# Altium schematic sheet 小四轴.SchDoc
size A3
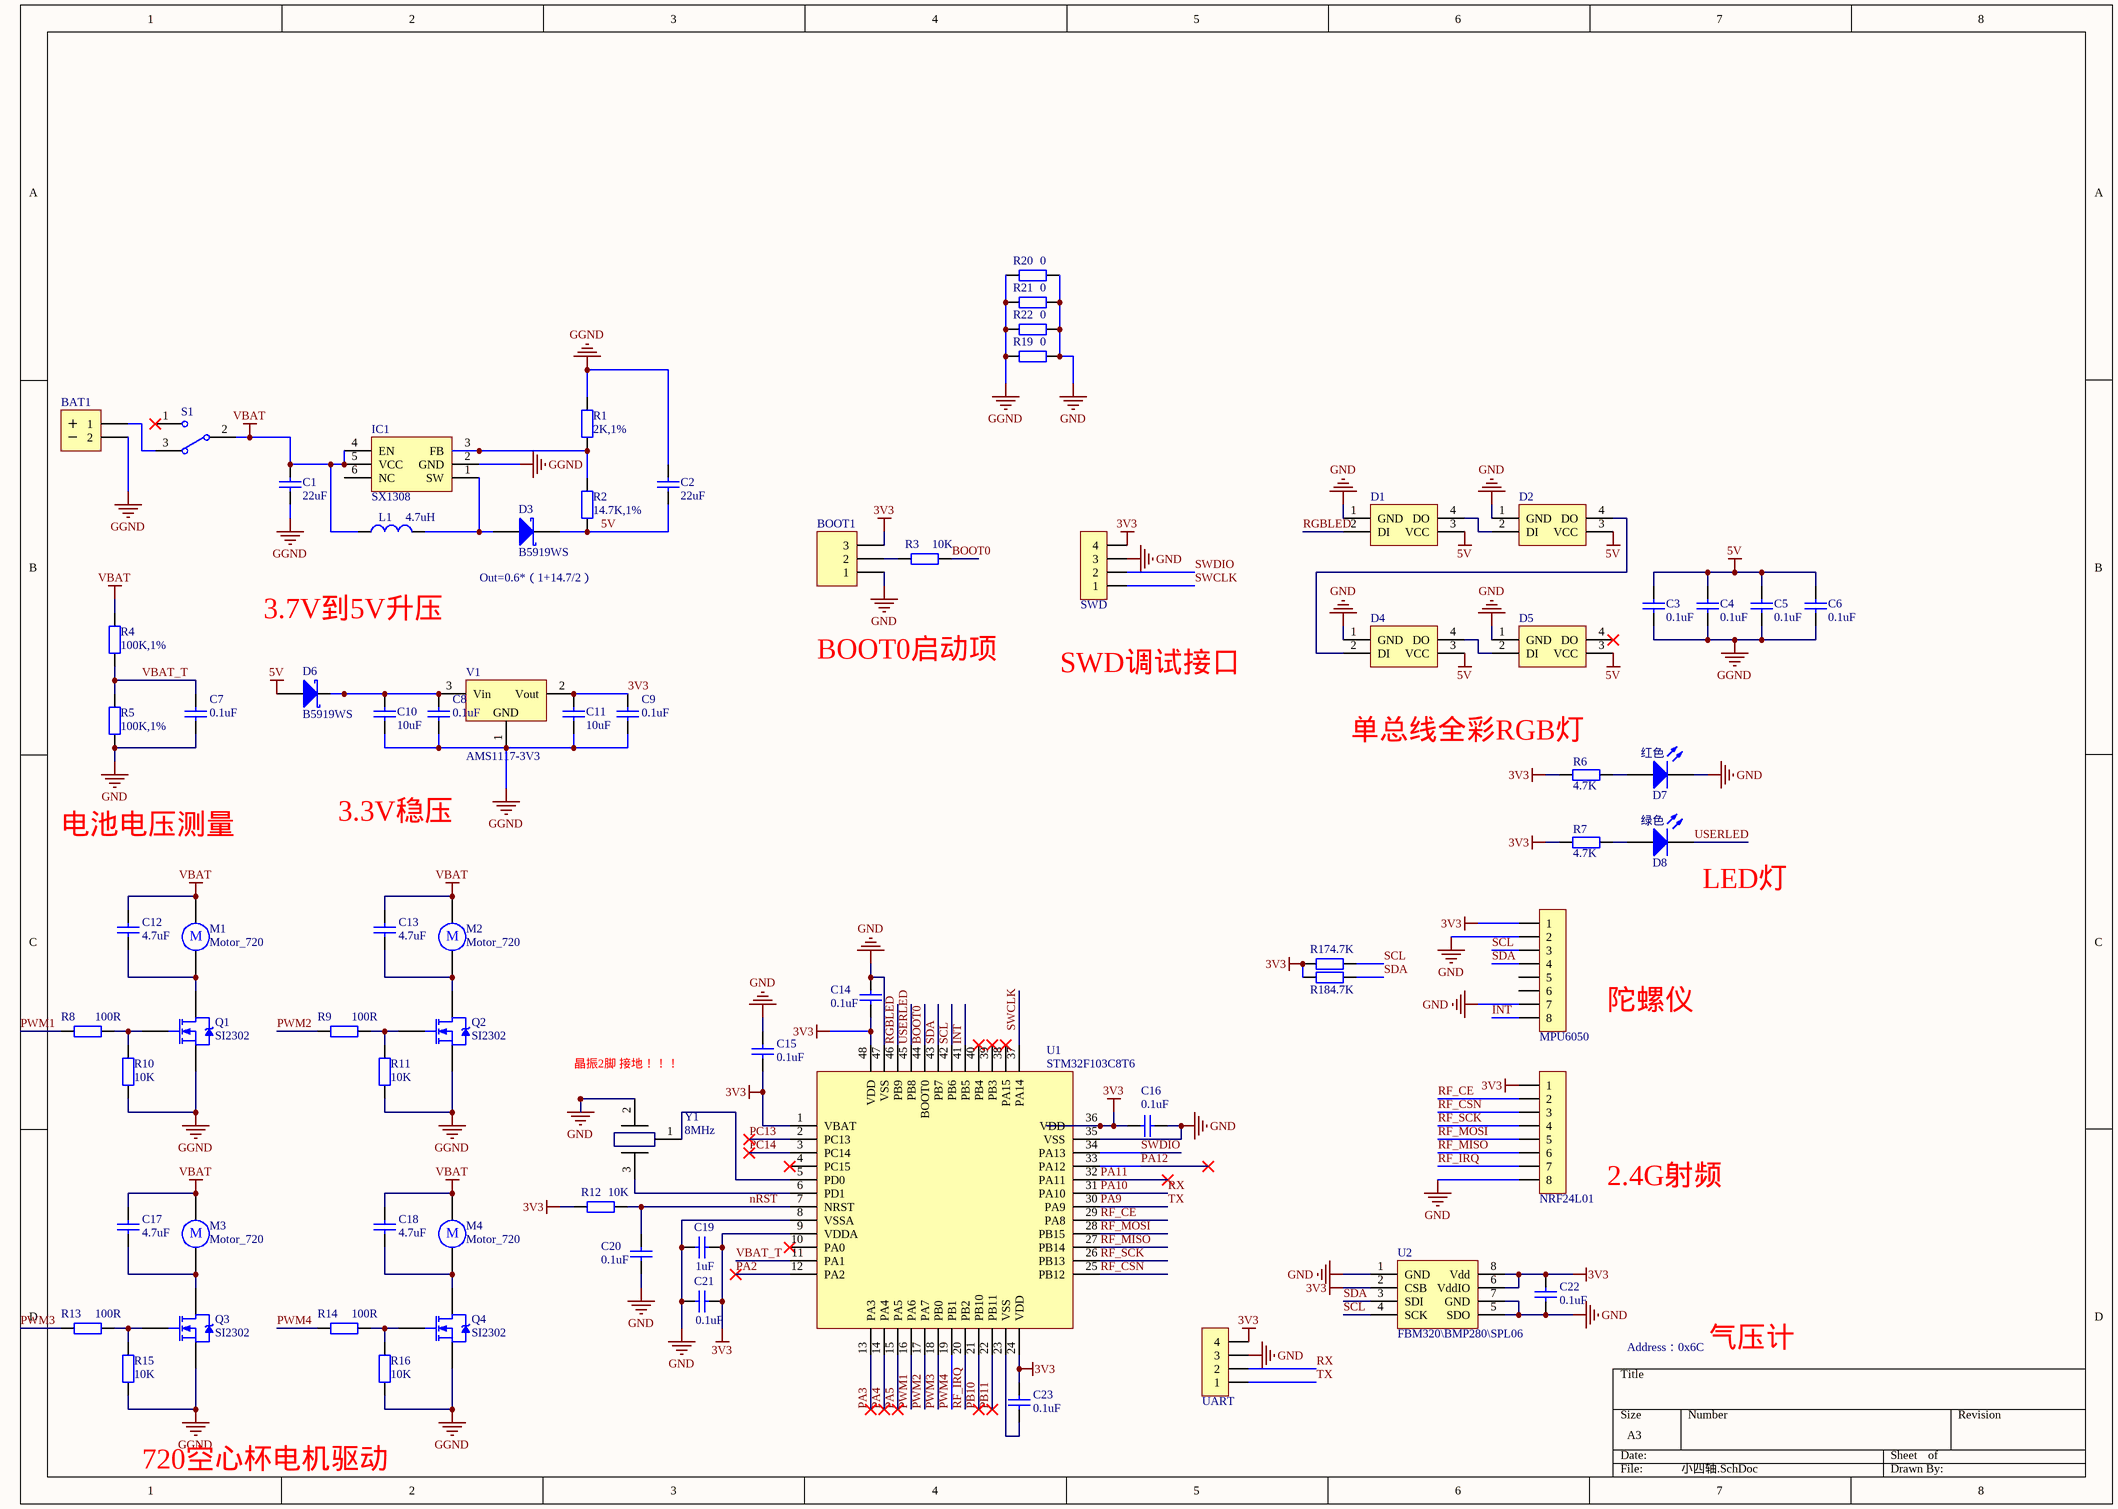
[diagram p0: 小四轴.SchDoc]

## Parts
BAT1  BAT  [HDR2.54-LI-2P]  (value not drawn)
BOOT1  BOOT  [HDR2.54-LI-3P]  (value not drawn)
C1  value 22uF  [C 0603_M]  (hidden comment: C_0603)
C2  value 22uF  [C 0603_M]  (hidden comment: C_0603)
C3  value 0.1uF  [C 0603_M]  (hidden comment: C_0603)
C4  value 0.1uF  [C 0603_M]  (hidden comment: C_0603)
C5  value 0.1uF  [C 0603_M]  (hidden comment: C_0603)
C6  value 0.1uF  [C 0603_M]  (hidden comment: C_0603)
C7  value 0.1uF  [C 0603_M]  (hidden comment: C_0603)
C8  value 0.1uF  [C 0603_M]  (hidden comment: C_0603)
C9  value 0.1uF  [C 0603_M]  (hidden comment: C_0603)
C10  value 10uF  [C 0603_M]  (hidden comment: C_0603)
C11  value 10uF  [C 0603_M]  (hidden comment: C_0603)
C12  value 4.7uF  [C 0603_M]  (hidden comment: C_0603)
C13  value 4.7uF  [C 0603_M]  (hidden comment: C_0603)
C14  value 0.1uF  [C 0603_M]  (hidden comment: C_0603)
C15  value 0.1uF  [C 0603_M]  (hidden comment: C_0603)
C16  value 0.1uF  [C 0603_M]  (hidden comment: C_0603)
C17  value 4.7uF  [C 0603_M]  (hidden comment: C_0603)
C18  value 4.7uF  [C 0603_M]  (hidden comment: C_0603)
C19  value 1uF  [C 0603_M]  (hidden comment: C_0603)
C20  value 0.1uF  [C 0603_M]  (hidden comment: C_0603)
C21  value 0.1uF  [C 0603_M]  (hidden comment: C_0603)
C22  value 0.1uF  [C 0603_M]  (hidden comment: C_0603)
C23  value 0.1uF  [C 0603_M]  (hidden comment: C_0603)
D1  P923D  [RGB_LED_5050]  (value not drawn)
D2  P923D  [RGB_LED_5050]  (value not drawn)
D3  B5919WS  [SOD-323]
D4  P923D  [RGB_LED_5050]  (value not drawn)
D5  P923D  [RGB_LED_5050]  (value not drawn)
D6  B5919WS  [SOD-323]
D7  红色  [LED 0603B]
D8  绿色  [LED 0603B]
IC1  SX1308  [SOT23-6N]
L1  value 4.7uH  [SWPA4012S]  (hidden comment: Inductor)
M1  Motor_720  [ZH1.5-LI-2p]
M2  Motor_720  [ZH1.5-LI-2p]
M3  Motor_720  [ZH1.5-LI-2p]
M4  Motor_720  [ZH1.5-LI-2p]
MPU6050  HDR-1X8  [HDR2.54-LI-8P]  (value not drawn)
NRF24L01  HDR-1X8  [HDR1.27-LI-8P]  (value not drawn)
Q1  SI2302  [SOT23-3M]
Q2  SI2302  [SOT23-3M]
Q3  SI2302  [SOT23-3M]
Q4  SI2302  [SOT23-3M]
R1  value 2K,1%  [R 0603_M]  (hidden comment: R_0603)
R2  value 14.7K,1%  [R 0603_M]  (hidden comment: R_0603)
R3  value 10K  [R 0603_M]  (hidden comment: R_0603)
R4  value 100K,1%  [R 0603_M]  (hidden comment: R_0603)
R5  value 100K,1%  [R 0603_M]  (hidden comment: R_0603)
R6  value 4.7K  [R 0603_M]  (hidden comment: R_0603)
R7  value 4.7K  [R 0603_M]  (hidden comment: R_0603)
R8  value 100R  [R 0603_M]  (hidden comment: R_0603)
R9  value 100R  [R 0603_M]  (hidden comment: R_0603)
R10  value 10K  [R 0603_M]  (hidden comment: R_0603)
R11  value 10K  [R 0603_M]  (hidden comment: R_0603)
R12  value 10K  [R 0603_M]  (hidden comment: R_0603)
R13  value 100R  [R 0603_M]  (hidden comment: R_0603)
R14  value 100R  [R 0603_M]  (hidden comment: R_0603)
R15  value 10K  [R 0603_M]  (hidden comment: R_0603)
R16  value 10K  [R 0603_M]  (hidden comment: R_0603)
R17  value 4.7K  [R 0603_M]  (hidden comment: R_0603)
R18  value 4.7K  [R 0603_M]  (hidden comment: R_0603)
R19  value 0  [R 0603_M]  (hidden comment: R_0603)
R20  value 0  [R 0603_M]  (hidden comment: R_0603)
R21  value 0  [R 0603_M]  (hidden comment: R_0603)
R22  value 0  [R 0603_M]  (hidden comment: R_0603)
S1  SW-SPDT  [SW-TH_OS102011MS2QN1]  (value not drawn)
SWD  HDR-1X4  [HDR2.54-LI-4P]  (value not drawn)
U1  STM32F103C8T6  [LQFP48-7*7]
U2  FBM320\BMP280\SPL06  [SENSOR-TH_BMP280-BL]
UART  HDR-1X4  [HDR2.54-LI-4P]  (value not drawn)
V1  AMS1117-3V3  [SOT223_L]
Y1  value 8MHz  [OSC-SMD_3P-L3.2-W1.3-P1.20-L]  (hidden comment: XTAL)

## Nets
3V3: BOOT1.3 C9.2 C11.2 C14.1 C15.2 C16.2 C19.2 C21.2 C22.1 C23.1 MPU6050.1 NRF24L01.1 R6.1 R7.1 R12.2 R17.1 R18.1 SWD.4 U1.1(VBAT) U1.9(VDDA) U1.24(VDD) U1.36(VDD) U1.48(VDD) U2.2(CSB) U2.6(VddIO) U2.8(Vdd) UART.4 V1.2(Vout)
5V: C2.1 C3.2 C4.2 C5.2 C6.2 D1.3(VCC) D2.3(VCC) D3.2(K) D4.3(VCC) D5.3(VCC) D6.1(A) R2.1
GGND: BAT1.2 C1.1 C2.2 C3.1 C4.1 C5.1 C6.1 C8.1 C9.1 C10.1 C11.1 IC1.2(GND) Q1.2(S) Q2.2(S) Q3.2(S) Q4.2(S) R1.2 R10.1 R11.1 R15.1 R16.1 R19.1 R20.1 R21.1 R22.1 V1.1(GND)
GND: BOOT1.1 C7.1 C14.2 C15.1 C16.1 C19.1 C20.1 C21.1 C22.2 D1.1(GND) D2.1(GND) D4.1(GND) D5.1(GND) D7.2 MPU6050.2 MPU6050.7 NRF24L01.8 R5.1 R19.2 R20.2 R21.2 R22.2 SWD.3 U1.8(VSSA) U1.35(VSS) U1.47(VSS) U2.1(GND) U2.5(SDO) U2.7(GND) UART.3 Y1.2
VBAT: C1.2 C12.2 C13.2 C17.2 C18.2 IC1.4(EN) IC1.5(VCC) L1.1 M1.1 M2.1 M3.1 M4.1 R4.2 S1.2
BOOT0: R3.2 U1.44(BOOT0)
INT: MPU6050.8 U1.41(PB5)
nRST: C20.2 R12.1 U1.7(NRST)
PA2: U1.12(PA2)
PA3: U1.13(PA3)
PA4: U1.14(PA4)
PA5: U1.15(PA5)
PA9: U1.30(PA9) UART.1  [also labelled TX]
PA10: U1.31(PA10) UART.2  [also labelled RX]
PA11: U1.32(PA11)
PA12: U1.33(PA12)
PB10: U1.21(PB10)
PB11: U1.22(PB11)
PC13: U1.2(PC13)
PC14: U1.3(PC14)
PWM1: R8.1 U1.16(PA6)
PWM2: R9.1 U1.17(PA7)
PWM3: R13.1 U1.18(PB0)
PWM4: R14.1 U1.19(PB1)
RF_CE: NRF24L01.2 U1.29(PA8)
RF_CSN: NRF24L01.3 U1.25(PB12)
RF_IRQ: NRF24L01.7 U1.20(PB2)
RF_MISO: NRF24L01.6 U1.27(PB14)
RF_MOSI: NRF24L01.5 U1.28(PB15)
RF_SCK: NRF24L01.4 U1.26(PB13)
RGBLED: D1.2(DI) U1.46(PB9)
SCL: MPU6050.3 R17.2 U1.42(PB6) U2.4(SCK)
SDA: MPU6050.4 R18.2 U1.43(PB7) U2.3(SDI)
SWCLK: SWD.1 U1.37(PA14)
SWDIO: SWD.2 U1.34(PA13)
USERLED: D8.2 U1.45(PB8)
VBAT_T: C7.2 R4.1 R5.2 U1.11(PA1)
NetBAT1_1: BAT1.1 S1.3
NetBOOT1_2: BOOT1.2 R3.1
NetC8_2: C8.2 C10.2 D6.2(K) V1.3(Vin)
NetC12_1: C12.1 M1.2 Q1.3(D)
NetC13_1: C13.1 M2.2 Q2.3(D)
NetC17_1: C17.1 M3.2 Q3.3(D)
NetC18_1: C18.1 M4.2 Q4.3(D)
NetC23_2: C23.2 U1.23(VSS)
NetD1_4: D1.4(DO) D2.2(DI)
NetD2_4: D2.4(DO) D4.2(DI)
NetD3_1: D3.1(A) IC1.1(SW) L1.2
NetD4_4: D4.4(DO) D5.2(DI)
NetD7_1: D7.1 R6.2
NetD8_1: D8.1 R7.2
NetIC1_3: IC1.3(FB) R1.1 R2.2
NetQ1_1: Q1.1(G) R8.2 R10.2
NetQ2_1: Q2.1(G) R9.2 R11.2
NetQ3_1: Q3.1(G) R13.2 R15.2
NetQ4_1: Q4.1(G) R14.2 R16.2
NetU1_5: U1.5(PD0) Y1.1
NetU1_6: U1.6(PD1) Y1.3

Not connected (* = marked no-connect by the designer): D5 4(DO)*; IC1 6(NC); MPU6050 5 6; S1 1*; U1 4(PC15)* 10(PA0)* 38(PA15)* 39(PB3)* 40(PB4)*

## Notes on the sheet
- Out=0.6*（1+14.7/2）
- 3.7V到5V升压
- BOOT0启动项
- SWD调试接口
- 单总线全彩RGB灯
- 电池电压测量
- 3.3V稳压
- (near D8) LED灯
- 陀螺仪
- 晶振2脚 接地！！！
- 2.4G射频
- Address：0x6C
- 气压计
- 720空心杯电机驱动
- (in symbol Motor_720) M

## Library data of the parts
BAT1 = BAT: Header, 2-Pin; Publisher: mazhongwei; Published: 8-August-2017; PackageReference: HDR1X2
BOOT1 = Header 3: Header, 3-Pin; LatestRevisionDate: 17-Jul-2002; LatestRevisionNote: Re-released for DXP Platform.; Publisher: Altium Limited
D3 D6 = 1N5819: 肖特基二极管; 淘宝ID: 封装库来自淘宝 ID：黄晶宝石; 属性: 40V/2A; BOM名称: 肖特基二极管; 欢迎光临: https://shop463601444.taobao.com
D7 D8 = LED 0603: 发光二极管; Published: 8-Jun-2000; LatestRevisionDate: 08-Jul-2005; LatestRevisionNote: Mech Layer 1 removed.; PackageReference: LED-0; Publisher: Altium Limited; PackageDescription: LED; 2 Leads
IC1 = SX1308: 可调升压芯片; 版权归属: 封装库来自淘宝 ID：黄晶宝石; BOM名称: 可调升压芯片; 学习资源: www.ooocke.com
L1 = Inductor: 电感; Code_IEC: 1005; Published: 8-Jun-2000; LatestRevisionDate: 17-Jul-2002; LatestRevisionNote: Re-released for DXP Platform.; PackageReference: 0402-A; Publisher: Altium Limited; Code_JEITA: 0402
M1-M4 = Motor_720: Motor, General Kind; Published: 8-August-2017; PackageReference: RB5-10.5; Publisher: mazhongwei
MPU6050 = Header 8: 8P接插件; 版权归属: 封装库来自淘宝 ID：黄晶宝石; BOM名称: 8P接插件; 学习资源: https://shop463601444.taobao.com
NRF24L01 = Header 8: 8P接插件; 封装库来自淘宝卖家 ID：黄晶宝石: https://shop463601444.taobao.com
Q1-Q4 = SI2302: N-Channel Power MOSFET; Published: 8-August-2017; PackageReference: SOT23-3; Publisher: mazhongwei
S1 = SW-SPDT: SPDT Subminiature Toggle Switch, Right Angle Mounting, Vertical Actuation; Published: 10-August-2017; PackageReference: SWITCH_PWR; Publisher: mazhongwei
SWD UART = Header 4: 4P接插件; 版权归属: 封装库来自淘宝 ID：黄晶宝石; BOM名称: 4P接插件; 学习资源: https://shop463601444.taobao.com
U2 = FBM320: 气压计; Published: 8-August-2017; Publisher: mazhongwei; PackageReference: LGA-2_5X2MM
V1 = AMS1117: 三端稳压芯片; BOM名称: 稳压芯片; 淘宝ID: 封装库来自淘宝 ID：黄晶宝石; 欢迎光临淘宝店铺: https://shop463601444.taobao.com
Y1 = XTAL_2: Publisher: mazhongwei; Published: 8-August-2017; PackageReference: SMD-cstse800G52-r0
C1-C23 = C_0603: Published: 8-Jun-2000; LatestRevisionDate: 17-Jul-2002; LatestRevisionNote: Re-released for DXP Platform.; PackageReference: RAD-0.3; Publisher: Altium Limited; PackageDescription: Radial Cap, Thru-Hole; 2 Leads; 0.3 in Pin Spacing
D1 D2 D4 D5 = P923D: Publisher: mazhongwei; Published: 8-August-2017; PackageReference: RGB_LED_5050
R1-R22 = R_0603: Published: 8-Jun-2000; LatestRevisionDate: 17-Jul-2002; LatestRevisionNote: Re-released for DXP Platform.; PackageReference: AXIAL-0.4; Publisher: Altium Limited; PackageDescription: Axial Device, Thru-Hole; 2 Leads; 0.4 in Pin Spacing